# Altium schematic sheet Relays_channels.SchDoc
size A4; SheetNumber: 9; SheetTotal: 10
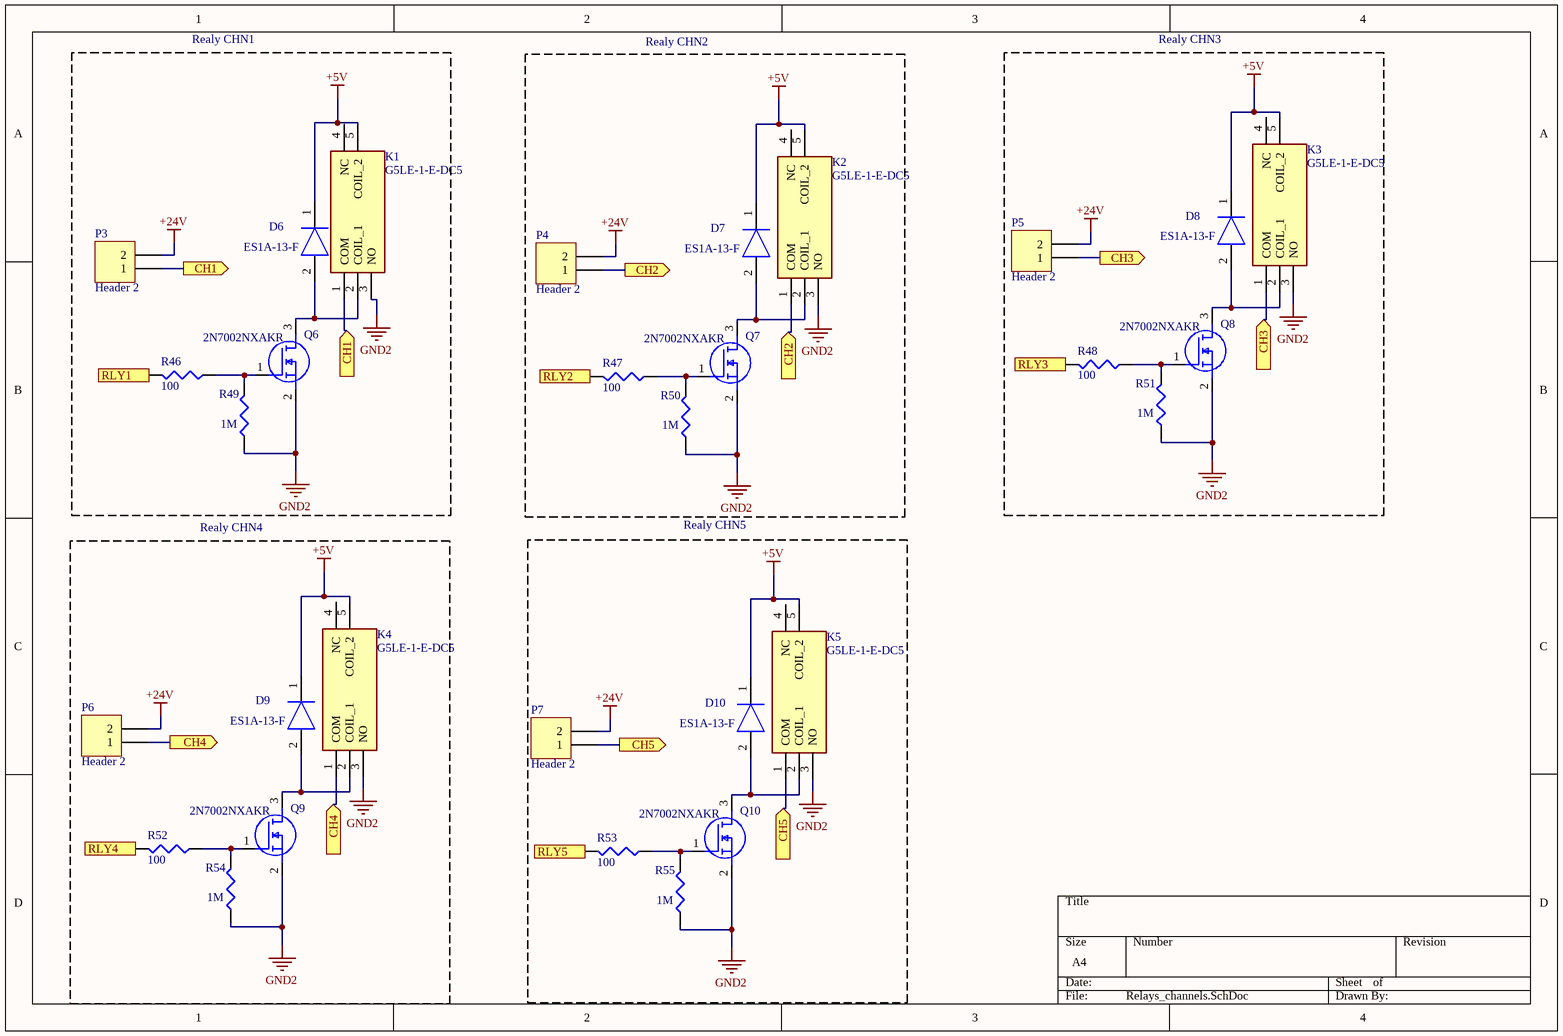
[diagram p0: Relays_channels.SchDoc]

## Parts
D6  ES1A-13-F  [DIOM5226X240N]
D7  ES1A-13-F  [DIOM5226X240N]
D8  ES1A-13-F  [DIOM5226X240N]
D9  ES1A-13-F  [DIOM5226X240N]
D10  ES1A-13-F  [DIOM5226X240N]
K1  G5LE-1-E-DC5  [G5LE-1]
K2  G5LE-1-E-DC5  [G5LE-1]
K3  G5LE-1-E-DC5  [G5LE-1]
K4  G5LE-1-E-DC5  [G5LE-1]
K5  G5LE-1-E-DC5  [G5LE-1]
P3  Header 2  [HDR1X2]
P4  Header 2  [HDR1X2]
P5  Header 2  [HDR1X2]
P6  Header 2  [HDR1X2]
P7  Header 2  [HDR1X2]
Q6  2N7002NXAKR  [SOT95P230X110-3N]
Q7  2N7002NXAKR  [SOT95P230X110-3N]
Q8  2N7002NXAKR  [SOT95P230X110-3N]
Q9  2N7002NXAKR  [SOT95P230X110-3N]
Q10  2N7002NXAKR  [SOT95P230X110-3N]
R46  value 100  [J1-0603]  (hidden comment: Res3)
R47  value 100  [J1-0603]  (hidden comment: Res3)
R48  value 100  [J1-0603]  (hidden comment: Res3)
R49  value 1M  [J1-0603]  (hidden comment: Res3)
R50  value 1M  [J1-0603]  (hidden comment: Res3)
R51  value 1M  [J1-0603]  (hidden comment: Res3)
R52  value 100  [J1-0603]  (hidden comment: Res3)
R53  value 100  [J1-0603]  (hidden comment: Res3)
R54  value 1M  [J1-0603]  (hidden comment: Res3)
R55  value 1M  [J1-0603]  (hidden comment: Res3)

## Blocks framed on the sheet
Realy CHN1: D6 K1 P3 Q6 R46 R49
Realy CHN2: D7 K2 P4 Q7 R47 R50
Realy CHN3: D8 K3 P5 Q8 R48 R51
Realy CHN4: D9 K4 P6 Q9 R52 R54
Realy CHN5: D10 K5 P7 Q10 R53 R55

## Ports
CH1 (in), CH1 (out), CH2 (in), CH2 (out), CH3 (in), CH3 (out), CH4 (in), CH4 (out), CH5 (in), CH5 (out), RLY1 (in), RLY2 (in), RLY3 (in), RLY4 (in), RLY5 (in)

## Nets
+5V: D6.1(K) D7.1(K) D8.1(K) D9.1(K) D10.1(K) K1.5(COIL_2) K2.5(COIL_2) K3.5(COIL_2) K4.5(COIL_2) K5.5(COIL_2)
+24V: P3.2 P4.2 P5.2 P6.2 P7.2
GND2: K1.3(NO) K2.3(NO) K3.3(NO) K4.3(NO) K5.3(NO) Q6.2(S) Q7.2(S) Q8.2(S) Q9.2(S) Q10.2(S) R49.1 R50.1 R51.1 R54.1 R55.1
CH1: K1.1(COM) P3.1 ; port CH1
CH2: K2.1(COM) P4.1 ; port CH2
CH3: K3.1(COM) P5.1 ; port CH3
CH4: K4.1(COM) P6.1 ; port CH4
CH5: K5.1(COM) P7.1 ; port CH5
RLY1: R46.2 ; port RLY1
RLY2: R47.2 ; port RLY2
RLY3: R48.2 ; port RLY3
RLY4: R52.2 ; port RLY4
RLY5: R53.2 ; port RLY5
NetD6_2: D6.2(A) K1.2(COIL_1) Q6.3(D)
NetD7_2: D7.2(A) K2.2(COIL_1) Q7.3(D)
NetD8_2: D8.2(A) K3.2(COIL_1) Q8.3(D)
NetD9_2: D9.2(A) K4.2(COIL_1) Q9.3(D)
NetD10_2: D10.2(A) K5.2(COIL_1) Q10.3(D)
NetQ6_1: Q6.1(G) R46.1 R49.2
NetQ7_1: Q7.1(G) R47.1 R50.2
NetQ8_1: Q8.1(G) R48.1 R51.2
NetQ9_1: Q9.1(G) R52.1 R54.2
NetQ10_1: Q10.1(G) R53.1 R55.2

Not connected (* = marked no-connect by the designer): K1 4(NC); K2 4(NC); K3 4(NC); K4 4(NC); K5 4(NC)

## Library data of the parts
D6-D10 = ES1A-13-F: Diode; Manufacturer_Name: Diodes Inc.; Datasheet Link: http://www.diodes.com/_files/datasheets/ds14001.pdf; Height: 2.4mm; Manufacturer_Part_Number: ES1A-13-F; Mouser Part Number: 621-ES1A-F; Mouser Price/Stock: https://www.mouser.co.uk/ProductDetail/Diodes-Incorporated/ES1A-13-F/?qs=CcKFP491uOOqYN0bONi7Aw%3D%3D; Arrow Part Number: ES1A-13-F; Arrow Price/Stock: https://www.arrow.com/en/products/es1a-13-f/diodes-incorporated
K1-K5 = G5LE-1-E-DC5: Relay or Contactor; Manufacturer_Name: Omron Electronics; Datasheet Link: https://componentsearchengine.com/Datasheets/1/G5LE-1-E-DC5.pdf; Manufacturer_Part_Number: G5LE-1-E-DC5; Mouser Part Number: 653-G5LE-1-E-DC5; Mouser Price/Stock: https://www.mouser.co.uk/ProductDetail/Omron-Electronics/G5LE-1-E-DC5/?qs=aEuGZpxfbxVbuaOF%252B%252BGlRA%3D%3D
P3-P7 = Header 2: Header, 2-Pin; LatestRevisionDate: 17-Jul-2002; LatestRevisionNote: Re-released for DXP Platform.; Publisher: Altium Limited
Q6-Q10 = 2N7002NXAKR: MOSFET (N-Channel); Manufacturer_Name: Nexperia; Datasheet Link: https://mouser.componentsearchengine.com/Datasheets/2/2N7002NXAKR.pdf; Height: 1.1mm; Manufacturer_Part_Number: 2N7002NXAKR; Mouser Part Number: 771-2N7002NXAKR; Mouser Price/Stock: https://www.mouser.co.uk/ProductDetail/Nexperia/2N7002NXAKR/?qs=%252B6g0mu59x7JoAsZYPFXqhw%3D%3D; Arrow Part Number: 2N7002NXAKR; Arrow Price/Stock: https://www.arrow.com/en/products/2n7002nxakr/nexperia
R46-R55 = Res3: Resistor; Published: 8-Jun-2000; LatestRevisionDate: 29-May-2009; LatestRevisionNote: IPC-7351 Footprint Added.; PackageReference: J1-0603; Publisher: Altium Limited; PackageDescription: Chip Resistor